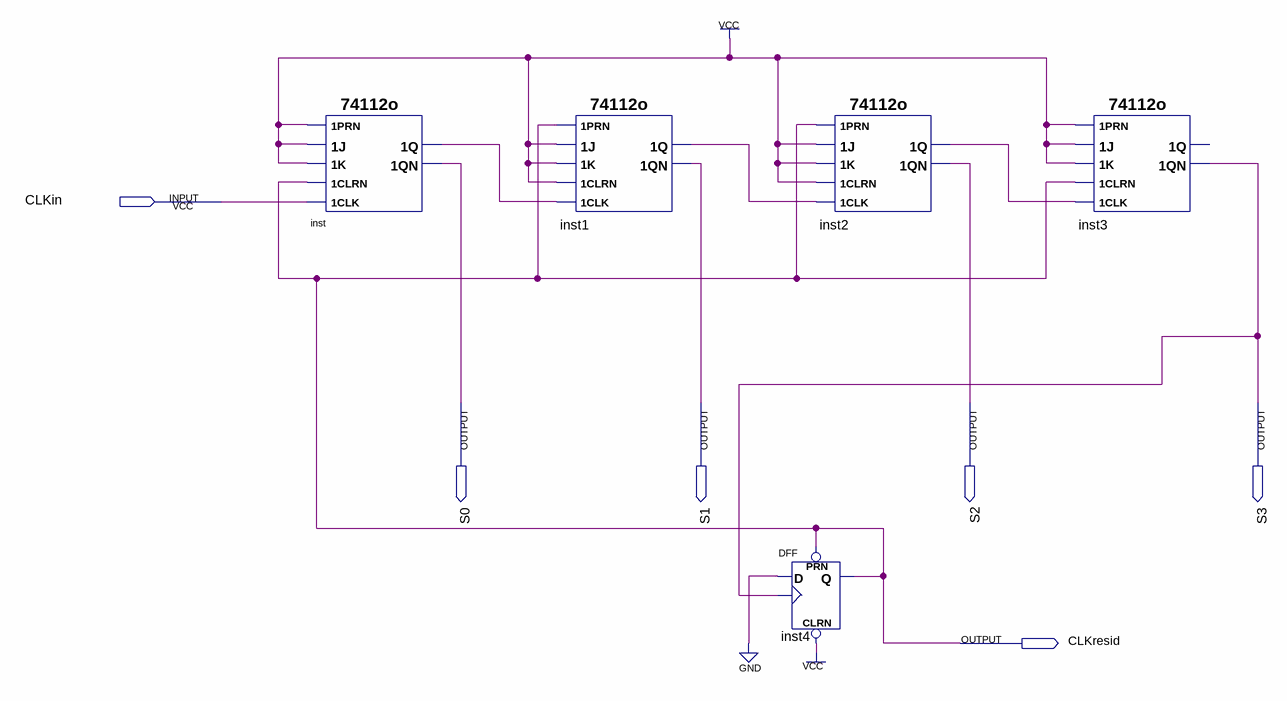
[diagram p0: schematic sheet]
// Quartus schematic ContadorDOWN.bdf as structural Verilog: 5 symbols, 6 pins
module ContadorDOWN (
  input  CLKin,
  output S0,
  output S1,
  output S2,
  output S3,
  output CLKresid
);

  wire inst1_1q, inst2_1q, inst_1q;

  \74112o  inst (
    .\1PRN (1'b1), .\1CLK (CLKin), .\1CLRN (CLKresid), .\1J (1'b1), .\1K (1'b1), .\1QN (S0), .\1Q (inst_1q));
  \74112o  inst1 (
    .\1PRN (CLKresid), .\1CLK (inst_1q), .\1CLRN (1'b1), .\1J (1'b1), .\1K (1'b1), .\1QN (S1), .\1Q (inst1_1q));
  \74112o  inst2 (
    .\1PRN (CLKresid), .\1CLK (inst1_1q), .\1CLRN (1'b1), .\1J (1'b1), .\1K (1'b1), .\1QN (S2),
    .\1Q (inst2_1q));
  DFF inst4 (.CLRN(1'b1), .CLK(S3), .D(1'b0), .PRN(CLKresid), .Q(CLKresid));
  \74112o  inst3 (
    .\1PRN (1'b1), .\1CLK (inst2_1q), .\1CLRN (CLKresid), .\1J (1'b1), .\1K (1'b1), .\1QN (S3));  // open: 1Q
endmodule
